# Altium project STM32H7-Board.PrjPCB
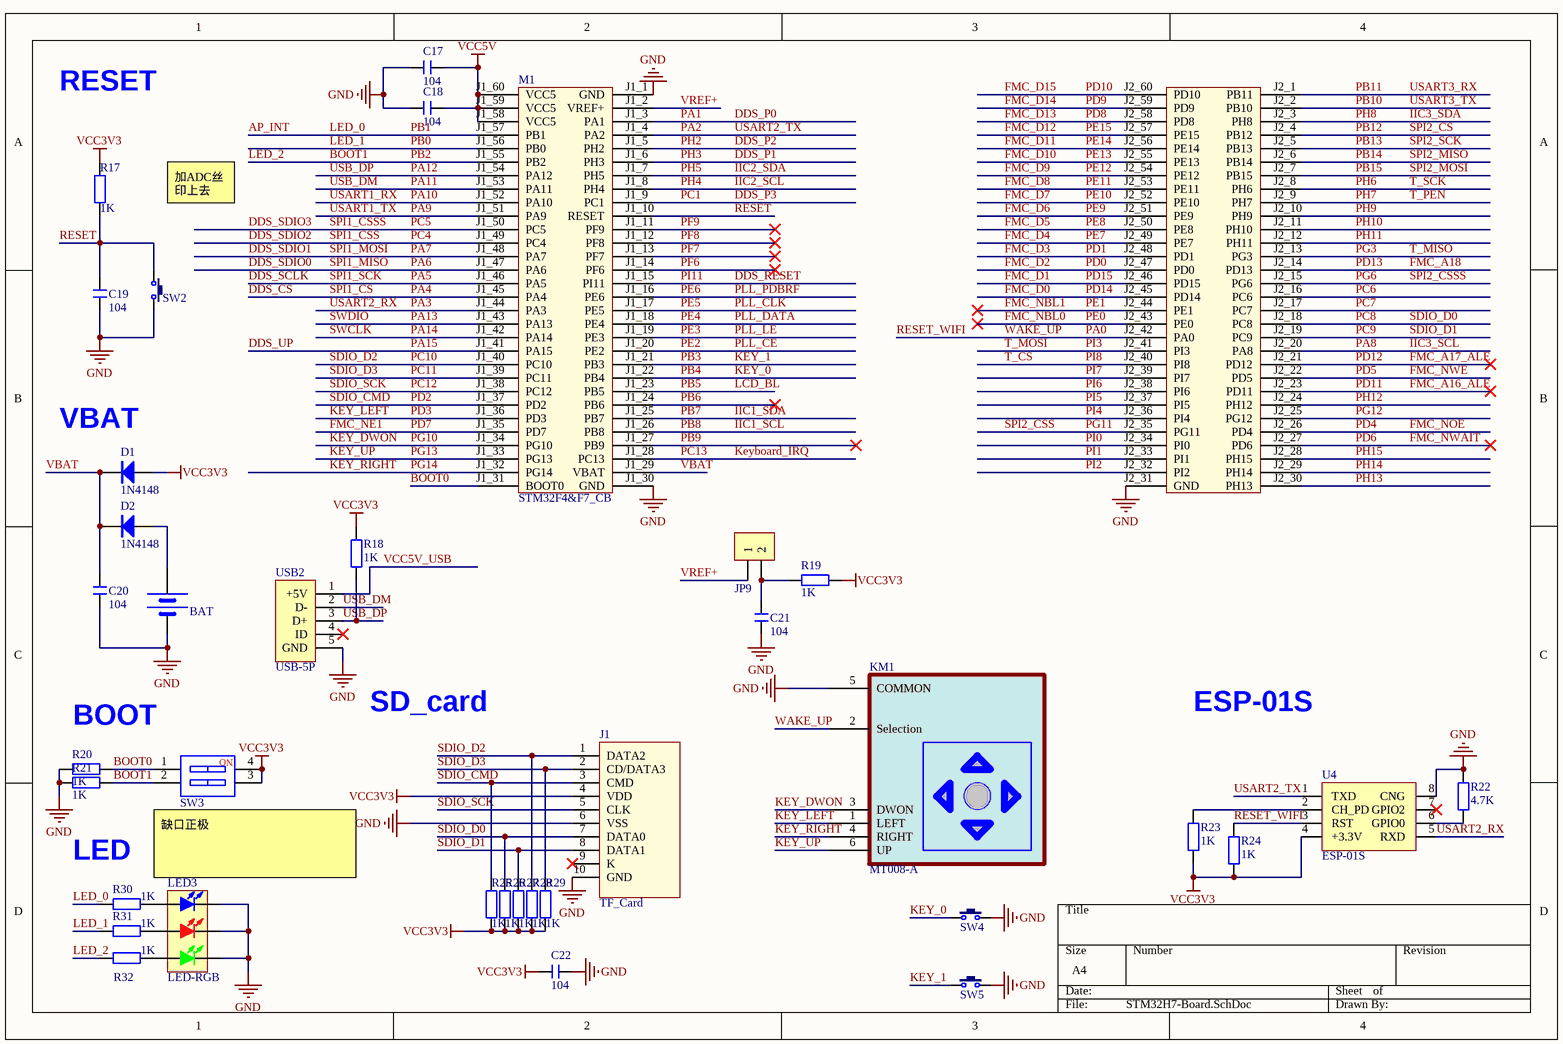
[diagram p0: STM32H7-Board.SchDoc]
5 sheets, 93 parts. Net scope: global (net labels, ports and power ports of the same name join across sheets).
Board file: STM32H7-Board.PcbDoc
Sheets:
  STM32H7-Board.SchDoc
  stlinkv2.1.SchDoc
  Power.SchDoc
  ports.SchDoc
  Sensors.SchDoc

## Sheet STM32H7-Board.SchDoc
size A4

### Parts
BAT  BATT  [BATM]  (value not drawn)
C17  104  [C 0603_L]
C18  104  [C 0603_L]
C19  104  [C 0603_L]
C20  104  [C 0603_L]
C21  104  [C 0603_L]
C22  104  [C 0603_L]
D1  1N4148  [SOD-323]
D2  1N4148  [MINI_MELF (LL34)]
J1  TF_Card  [Micro SD]
JP9  HDR-1X2  [HDR2.54-LI-2P]  (value not drawn)
KM1  MT008-A  [JOY_MT008-A]
LED3  LED-RGB  [LED 5050]
M1  STM32F4&F7_CB  [STM32F4&F7_CB]
R17  1K  [R 0603_L]
R18  1K  [R 0603_L]
R19  1K  [R 0603_L]
R20  1K  [R 0603_L]
R21  1K  [R 0603_L]
R22  4.7K  [R 0603_L]
R23  1K  [R 0603_L]
R24  1K  [R 0603_L]
R25  1K  [R 0603_L]
R26  1K  [R 0603_L]
R27  1K  [R 0603_L]
R28  1K  [R 0603_L]
R29  1K  [R 0603_L]
R30  1K  [R 0603_L]
R31  1K  [R 0603_L]
R32  1K  [R 0603_L]
SW2  3x6x5  [TSW SMD-3*6*2.5]  (value not drawn)
SW3  CSW-2P  [CSW1.27 SMD-2P]  (value not drawn)
SW4  3x6x5  [SODFL700X110-2N]  (value not drawn)
SW5  3x6x5  [SODFL700X110-2N]  (value not drawn)
U4  ESP-01S  [ESP-01S]
USB2  USB-5P  [USB-MICRO_B]

### Nets
GND: BAT.2(GND) C17.1 C18.1 C19.1 C20.1 C21.1 C22.2 J1.6(VSS) J1.10(GND) KM1.5(COMMON) LED3.2(BULE_K) LED3.4(RED_K) LED3.6(GREEN_K) M1.J1_1(GND) M1.J1_30(GND) M1.J2_31(GND) R20.1 R21.1 R22.2 SW2.2 SW4.2 SW5.2 U4.8(CNG) USB2.5(GND)
VCC3V3: C22.1 D1.1(A) J1.4(VDD) R17.2 R18.1 R19.2 R23.2 R24.2 R25.1 R26.1 R27.1 R28.1 R29.1 SW3.3 SW3.4 U4.4(+3.3V)
VCC5V: C17.2 C18.2 M1.J1_58(VCC5) M1.J1_59(VCC5) M1.J1_60(VCC5)
AP_INT: M1.J1_57(PB1) R30.2  [also labelled LED_0, PB1]
BOOT0: M1.J1_31(BOOT0) R20.2 SW3.1
BOOT1: M1.J1_55(PB2) R21.2 R32.2 SW3.2  [also labelled LED_2, PB2]
DDS_CS: M1.J1_45(PA4)  [also labelled PA4, SPI1_CS]
DDS_P0: M1.J1_3(PA1)  [also labelled PA1]
DDS_P1: M1.J1_6(PH3)  [also labelled PH3]
DDS_P2: M1.J1_5(PH2)  [also labelled PH2]
DDS_P3: M1.J1_9(PC1)  [also labelled PC1]
DDS_RESET: M1.J1_15(PI11)  [also labelled PI11]
DDS_SCLK: M1.J1_46(PA5)  [also labelled PA5, SPI1_SCK]
DDS_SDIO0: M1.J1_47(PA6)  [also labelled PA6, SPI1_MISO]
DDS_SDIO1: M1.J1_48(PA7)  [also labelled PA7, SPI1_MOSI]
DDS_SDIO2: M1.J1_49(PC4)  [also labelled PC4, SPI1_CSS]
DDS_SDIO3: M1.J1_50(PC5)  [also labelled PC5, SPI1_CSSS]
DDS_UP: M1.J1_41(PA15)  [also labelled PA15]
FMC_A16_ALE: M1.J2_23(PD11)  [also labelled PD11]
FMC_A17_ALE: M1.J2_21(PD12)  [also labelled PD12]
FMC_A18: M1.J2_14(PD13)  [also labelled PD13]
FMC_D0: M1.J2_45(PD14)  [also labelled PD14]
FMC_D1: M1.J2_46(PD15)  [also labelled PD15]
FMC_D2: M1.J2_47(PD0)  [also labelled PD0]
FMC_D3: M1.J2_48(PD1)  [also labelled PD1]
FMC_D4: M1.J2_49(PE7)  [also labelled PE7]
FMC_D5: M1.J2_50(PE8)  [also labelled PE8]
FMC_D6: M1.J2_51(PE9)  [also labelled PE9]
FMC_D7: M1.J2_52(PE10)  [also labelled PE10]
FMC_D8: M1.J2_53(PE11)  [also labelled PE11]
FMC_D9: M1.J2_54(PE12)  [also labelled PE12]
FMC_D10: M1.J2_55(PE13)  [also labelled PE13]
FMC_D11: M1.J2_56(PE14)  [also labelled PE14]
FMC_D12: M1.J2_57(PE15)  [also labelled PE15]
FMC_D13: M1.J2_58(PD8)  [also labelled PD8]
FMC_D14: M1.J2_59(PD9)  [also labelled PD9]
FMC_D15: M1.J2_60(PD10)  [also labelled PD10]
FMC_NBL0: M1.J2_43(PE0)  [also labelled PE0]
FMC_NBL1: M1.J2_44(PE1)  [also labelled PE1]
FMC_NE1: M1.J1_35(PD7)  [also labelled PD7]
FMC_NOE: M1.J2_26(PD4)  [also labelled PD4]
FMC_NWAIT: M1.J2_27(PD6)  [also labelled PD6]
FMC_NWE: M1.J2_22(PD5)  [also labelled PD5]
IIC1_SCL: M1.J1_26(PB8)  [also labelled PB8]
IIC1_SDA: M1.J1_25(PB7)  [also labelled PB7]
IIC2_SCL: M1.J1_8(PH4)  [also labelled PH4]
IIC2_SDA: M1.J1_7(PH5)  [also labelled PH5]
IIC3_SCL: M1.J2_20(PA8)  [also labelled PA8]
IIC3_SDA: M1.J2_3(PH8)  [also labelled PH8]
KEY_0: M1.J1_22(PB4) SW4.1  [also labelled PB4]
KEY_1: M1.J1_21(PB3) SW5.1  [also labelled PB3]
KEY_DWON: KM1.3(DWON) M1.J1_34(PG10)  [also labelled PG10]
KEY_LEFT: KM1.1(LEFT) M1.J1_36(PD3)  [also labelled PD3]
KEY_RIGHT: KM1.4(RIGHT) M1.J1_32(PG14)  [also labelled PG14]
KEY_UP: KM1.6(UP) M1.J1_33(PG13)  [also labelled PG13]
Keyboard_IRQ: M1.J1_28(PC13)  [also labelled PC13]
LCD_BL: M1.J1_23(PB5)  [also labelled PB5]
LED_1: M1.J1_56(PB0) R31.2  [also labelled PB0]
PA0: KM1.2(Selection) M1.J2_42(PA0) R24.1 U4.3(RST)  [also labelled RESET_WIFI, WAKE_UP]
PA2: M1.J1_4(PA2) U4.1(TXD)  [also labelled USART2_TX]
PA3: M1.J1_44(PA3) U4.5(RXD)  [also labelled USART2_RX]
PA9: M1.J1_51(PA9)  [also labelled USART1_TX]
PA10: M1.J1_52(PA10)  [also labelled USART1_RX]
PA11: M1.J1_53(PA11) USB2.2(D-)  [also labelled USB_DM]
PA12: M1.J1_54(PA12) R18.2 USB2.3(D+)  [also labelled USB_DP]
PA13: M1.J1_43(PA13)  [also labelled SWDIO]
PA14: M1.J1_42(PA14)  [also labelled SWCLK]
PB6: M1.J1_24(PB6)
PB9: M1.J1_27(PB9)
PB10: M1.J2_2(PB10)  [also labelled USART3_TX]
PB11: M1.J2_1(PB11)  [also labelled USART3_RX]
PB12: M1.J2_4(PB12)  [also labelled SPI2_CS]
PB13: M1.J2_5(PB13)  [also labelled SPI2_SCK]
PB14: M1.J2_6(PB14)  [also labelled SPI2_MISO]
PB15: M1.J2_7(PB15)  [also labelled SPI2_MOSI]
PC6: M1.J2_16(PC6)
PC7: M1.J2_17(PC7)
PC8: J1.7(DATA0) M1.J2_18(PC8) R26.2  [also labelled SDIO_D0]
PC9: J1.8(DATA1) M1.J2_19(PC9) R27.2  [also labelled SDIO_D1]
PC10: J1.1(DATA2) M1.J1_40(PC10) R28.2  [also labelled SDIO_D2]
PC11: J1.2(CD/DATA3) M1.J1_39(PC11) R29.2  [also labelled SDIO_D3]
PC12: J1.5(CLK) M1.J1_38(PC12)  [also labelled SDIO_SCK]
PD2: J1.3(CMD) M1.J1_37(PD2) R25.2  [also labelled SDIO_CMD]
PE2: M1.J1_20(PE2)  [also labelled PLL_CE]
PE3: M1.J1_19(PE3)  [also labelled PLL_LE]
PE4: M1.J1_18(PE4)  [also labelled PLL_DATA]
PE5: M1.J1_17(PE5)  [also labelled PLL_CLK]
PE6: M1.J1_16(PE6)  [also labelled PLL_PDBRF]
PF6: M1.J1_14(PF6)
PF7: M1.J1_13(PF7)
PF8: M1.J1_12(PF8)
PF9: M1.J1_11(PF9)
PG3: M1.J2_13(PG3)  [also labelled T_MISO]
PG6: M1.J2_15(PG6)  [also labelled SPI2_CSSS]
PG11: M1.J2_35(PG11)  [also labelled SPI2_CSS]
PG12: M1.J2_25(PG12)
PH6: M1.J2_8(PH6)  [also labelled T_SCK]
PH7: M1.J2_9(PH7)  [also labelled T_PEN]
PH9: M1.J2_10(PH9)
PH10: M1.J2_11(PH10)
PH11: M1.J2_12(PH11)
PH12: M1.J2_24(PH12)
PH13: M1.J2_30(PH13)
PH14: M1.J2_29(PH14)
PH15: M1.J2_28(PH15)
PI0: M1.J2_34(PI0)
PI1: M1.J2_33(PI1)
PI2: M1.J2_32(PI2)
PI3: M1.J2_41(PI3)  [also labelled T_MOSI]
PI4: M1.J2_36(PI4)
PI5: M1.J2_37(PI5)
PI6: M1.J2_38(PI6)
PI7: M1.J2_39(PI7)
PI8: M1.J2_40(PI8)  [also labelled T_CS]
RESET: C19.2 M1.J1_10(RESET) R17.1 SW2.1
VBAT: C20.2 D1.2(K) D2.2(K) M1.J1_29(VBAT)
VCC5V_USB: USB2.1(+5V)
VREF+: JP9.1 M1.J1_2(VREF+)
NetBAT_1: BAT.1(VCC) D2.1(A)
NetC21_2: C21.2 JP9.2 R19.1
NetLED3_1: LED3.1(BULE_A) R30.1
NetLED3_3: LED3.3(RED_A) R31.1
NetLED3_5: LED3.5(GREEN_A) R32.1
NetR22_1: R22.1 U4.6(GPIO0)
NetR23_1: R23.1 U4.2(CH_PD)

Not connected (* = marked no-connect by the designer): J1 9(K)*; U4 7(GPIO2)*; USB2 4(ID)*

### Notes on the sheet
- RESET
- 加ADC丝印上去
- (near D1) VBAT
- BOOT
- SD_card
- ESP-01S
- LED
- 缺口正极
- (in symbol CSW-2P) NO

### Library data of the parts
BAT = BAT
C17-C22 = C: 无极性贴片电容; 版权归属: 源创客; BOM名称: 无极性贴片电容; 学习资源: www.ooocke.com
D1 D2 = 1N4148: 高速开关二极管; 版权归属: 源创客; BOM名称: 高速开关二极管; 学习资源: www.ooocke.com
J1 = TF_Card: TF卡座; 版权归属: 源创客; BOM名称: TF卡座; 学习资源: www.ooocke.com
JP9 = Header 2: 2P接插件; 版权归属: 源创客; BOM名称: 2P接插件; 学习资源: www.ooocke.com
KM1 = MT-008A
LED3 = LED-RGB: 三基色LED; 版权归属: 源创客; BOM名称: 三基色LED; 学习资源: www.ooocke.com
M1 = STM32F4&F7_CB: F429/746 Core Board
R17-R32 = R: 贴片电阻; 版权归属: 源创客; BOM名称: 贴片电阻; 学习资源: www.ooocke.com
SW2 SW4 SW5 = TSW 3x6: 3x6轻触开关; 版权归属: 源创客; BOM名称: 3x6轻触开关; 学习资源: www.ooocke.com
SW3 = CSW-2P: 2路编码开关; 版权归属: 源创客; BOM名称: 2路编码开关; 学习资源: www.ooocke.com
USB2 = USB-5P: 微型USB母座; 版权归属: 源创客; BOM名称: 微型USB母座; 学习资源: www.ooocke.com

## Sheet stlinkv2.1.SchDoc
size A4
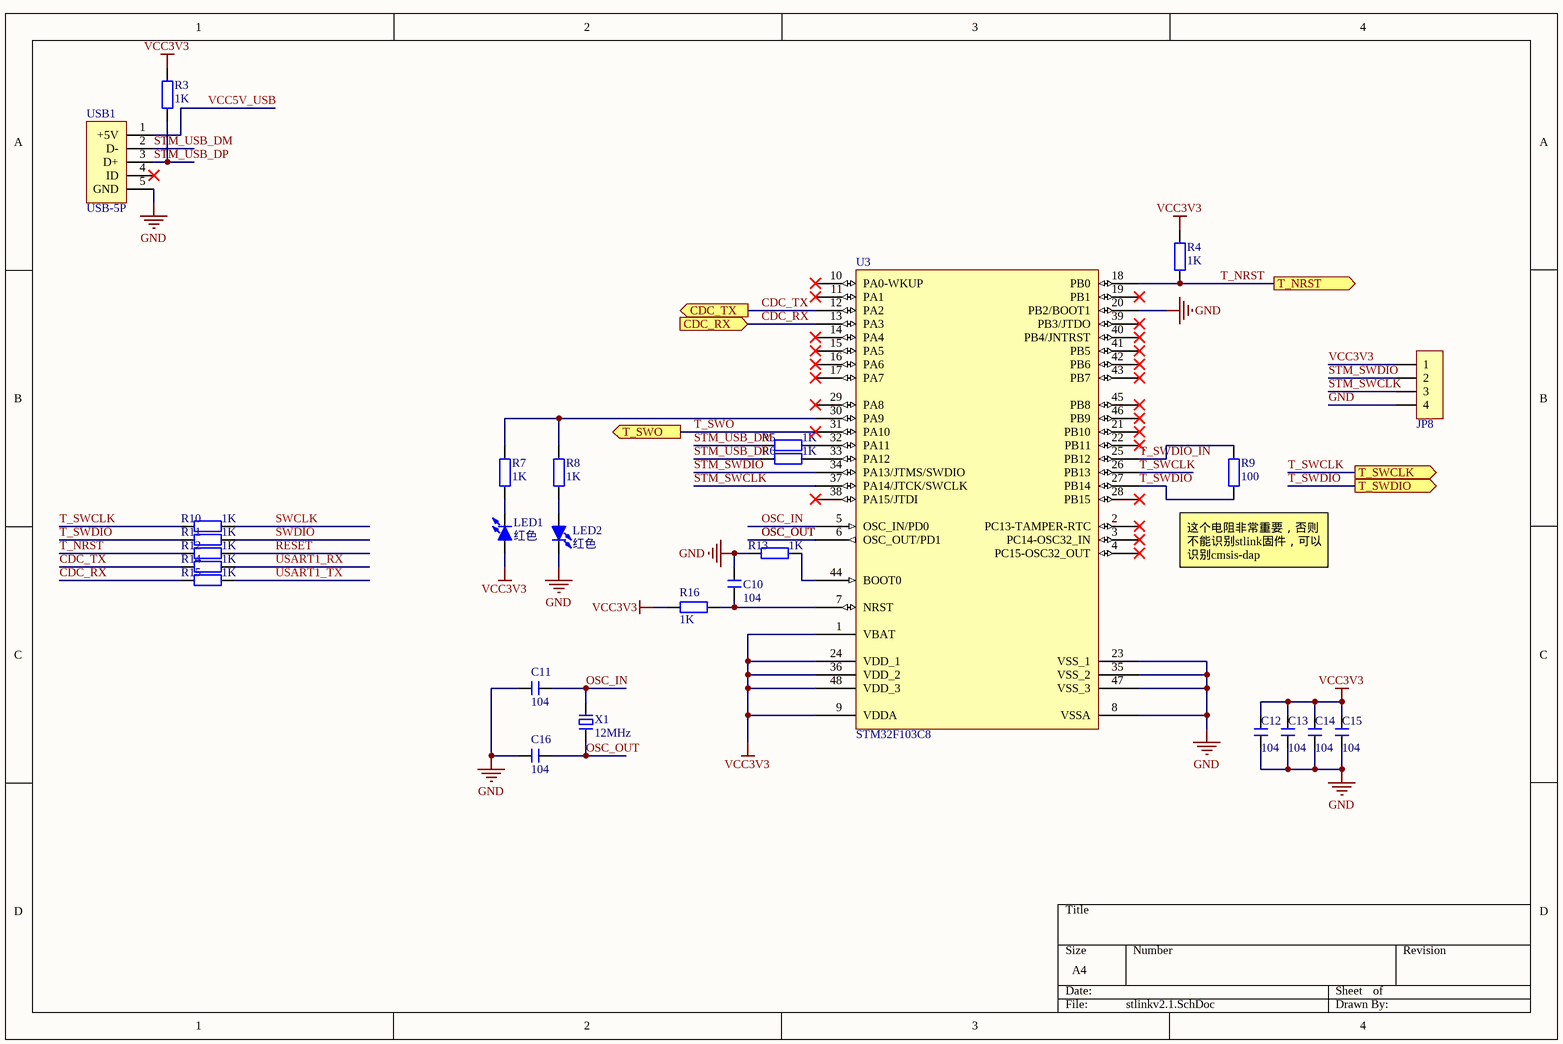
[diagram p1: stlinkv2.1.SchDoc]

### Parts
C10  104  [C 0603_L]
C11  104  [C 0603_L]
C12  104  [C 0603_L]
C13  104  [C 0603_L]
C14  104  [C 0603_L]
C15  104  [C 0603_L]
C16  104  [C 0603_L]
JP8  HDR-1X4  [HDR2.54-LI-4P]  (value not drawn)
LED1  红色  [LED 0603B]
LED2  红色  [LED 0603B]
R3  1K  [R 0603_L]
R4  1K  [R 0603_L]
R5  1K  [R 0603_L]
R6  1K  [R 0603_L]
R7  1K  [R 0603_L]
R8  1K  [R 0603_L]
R9  100  [R 0603_L]
R10  1K  [R 0603_L]
R11  1K  [R 0603_L]
R12  1K  [R 0603_L]
R13  1K  [R 0603_L]
R14  1K  [R 0603_L]
R15  1K  [R 0603_L]
R16  1K  [R 0603_L]
U3  STM32F103C8  [LQFP48 7X7_M]
USB1  USB-5P  [USB-MICRO_B]
X1  12MHz  [OSC 5032-2P]

### Ports
CDC_RX (in), CDC_TX (out), T_NRST (out), T_SWCLK (out), T_SWDIO (out), T_SWO (out)

### Nets
GND: C10.1 C11.1 C12.2 C13.2 C14.2 C15.2 C16.1 JP8.4 LED2.2(K) R13.2 U3.8(VSSA) U3.20(PB2/BOOT1) U3.23(VSS_1) U3.35(VSS_2) U3.47(VSS_3) USB1.5(GND)
VCC3V3: C12.1 C13.1 C14.1 C15.1 JP8.1 LED1.1(A) R3.1 R4.2 R16.2 U3.1(VBAT) U3.9(VDDA) U3.24(VDD_1) U3.36(VDD_2) U3.48(VDD_3)
CDC_RX: R15.2 U3.13(PA3) ; port CDC_RX
CDC_TX: R14.2 U3.12(PA2) ; port CDC_TX
OSC_IN: C11.2 U3.5(OSC_IN/PD0) X1.2
OSC_OUT: C16.2 U3.6(OSC_OUT/PD1) X1.1
RESET: R12.1
STM_SWCLK: JP8.3 U3.37(PA14/JTCK/SWCLK)
STM_SWDIO: JP8.2 U3.34(PA13/JTMS/SWDIO)
STM_USB_DM: R5.2 USB1.2(D-)
STM_USB_DP: R3.2 R6.2 USB1.3(D+)
SWCLK: R10.1  [project net PA14]
SWDIO: R11.1  [project net PA13]
T_NRST: R4.1 R12.2 U3.18(PB0) ; port T_NRST
T_SWCLK: R10.2 U3.26(PB13) ; port T_SWCLK
T_SWDIO: R9.1 R11.2 U3.27(PB14) ; port T_SWDIO
T_SWDIO_IN: R9.2 U3.25(PB12)
T_SWO: U3.31(PA10) ; port T_SWO
USART1_RX: R14.1  [project net PA10]
USART1_TX: R15.1  [project net PA9]
VCC5V_USB: USB1.1(+5V)
NetC10_2: C10.2 R16.1 U3.7(NRST)
NetLED1_2: LED1.2(K) R7.1
NetLED2_1: LED2.1(A) R8.1
NetR5_1: R5.1 U3.32(PA11)
NetR6_1: R6.1 U3.33(PA12)
NetR7_2: R7.2 R8.2 U3.30(PA9)
NetR13_1: R13.1 U3.44(BOOT0)

Not connected (* = marked no-connect by the designer): U3 2(PC13-TAMPER-RTC)* 3(PC14-OSC32_IN)* 4(PC15-OSC32_OUT)* 10(PA0-WKUP)* 11(PA1)* 14(PA4)* 15(PA5)* 16(PA6)* 17(PA7)* 19(PB1)* 21(PB10)* 22(PB11)* 28(PB15)* 29(PA8)* 38(PA15/JTDI)* 39(PB3/JTDO)* 40(PB4/JNTRST)* 41(PB5)* 42(PB6)* 43(PB7)* 45(PB8)* 46(PB9)*; USB1 4(ID)*

### Notes on the sheet
- (near R9) 这个电阻非常重要，否则不能识别stlink固件，可以识别cmsis-dap

### Library data of the parts
C10-C16 = C: 无极性贴片电容; 版权归属: 源创客; BOM名称: 无极性贴片电容; 学习资源: www.ooocke.com
JP8 = Header 4: 4P接插件; 版权归属: 源创客; BOM名称: 4P接插件; 学习资源: www.ooocke.com
LED1 LED2 = LED-SMD: 贴片LED; 版权归属: 源创客; BOM名称: 贴片LED; 学习资源: www.ooocke.com
R3-R16 = R: 贴片电阻; 版权归属: 源创客; BOM名称: 贴片电阻; 学习资源: www.ooocke.com
U3 = STM32F103C8: Flaah:64/RAM:20/IO:36; BOM名称: 32位STM单片机; 版权归属: 源创客; 学习资源: www.ooocke.com
USB1 = USB-5P: 微型USB母座; 版权归属: 源创客; BOM名称: 微型USB母座; 学习资源: www.ooocke.com
X1 = XTAL-2P: 2脚无源脚晶振; 版权归属: 源创客; BOM名称: 2脚无源脚晶振; 学习资源: www.ooocke.com

## Sheet Power.SchDoc
size A4
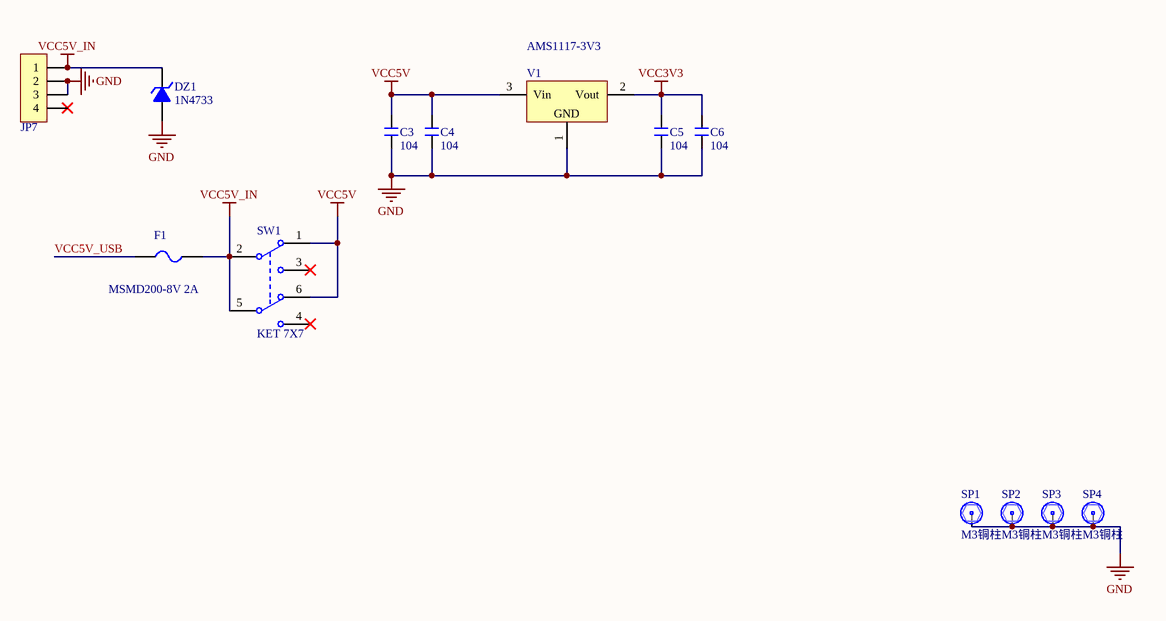
[diagram p2: Power.SchDoc]

### Parts
C3  104  [C 1812_L]
C4  104  [C 1812_L]
C5  104  [C 1206_M]
C6  104  [C 1206_M]
DZ1  1N4733  [SMA]
F1  MSMD200-8V 2A  [FU 1210]
JP7  HDR-1X4  [VH3.96-LI-4P]  (value not drawn)
SP1  M3铜柱  [M3x4_L]
SP2  M3铜柱  [M3x4_L]
SP3  M3铜柱  [M3x4_L]
SP4  M3铜柱  [M3x4_L]
SW1  KET 7X7  [KFT DIP-7X7]
V1  AMS1117-3V3  [SOT223_L]

### Nets
GND: C3.1 C4.1 C5.1 C6.1 DZ1.1(A) JP7.2 JP7.3 SP1.1 SP2.1 SP3.1 SP4.1 V1.1(GND)
VCC3V3: C5.2 C6.2 V1.2(Vout)
VCC5V: C3.2 C4.2 SW1.1(NC1) SW1.6(NC2) V1.3(Vin)
VCC5V_IN: DZ1.2(K) F1.2 JP7.1 SW1.2(COM2) SW1.5(COM2)
VCC5V_USB: F1.1

Not connected (* = marked no-connect by the designer): JP7 4*; SW1 3(NO1)* 4(NO2)*

### Library data of the parts
C3-C6 = C: 无极性贴片电容; 版权归属: 源创客; BOM名称: 无极性贴片电容; 学习资源: www.ooocke.com
DZ1 = 1N4733: 5.1V/1W稳压管; 版权归属: 源创客; BOM名称: 5.1V/1W稳压管; 学习资源: www.ooocke.com
F1 = FU: 贴片保险丝; 版权归属: 源创客; BOM名称: 贴片保险丝; 学习资源: www.ooocke.com
JP7 = Header 4: 4P接插件; 版权归属: 源创客; BOM名称: 4P接插件; 学习资源: www.ooocke.com
SP1-SP4 = 铜柱小焊盘: 铜柱; 版权归属: 源创客; BOM名称: 铜柱; 学习资源: www.ooocke.com
SW1 = KET 7X7: 7*7自锁开关; 版权归属: 源创客; BOM名称: 7*7自锁开关; 学习资源: www.ooocke.com
V1 = AMS1117: 三端稳压芯片; BOM名称: 稳压芯片; 版权归属: 源创客; 学习资源: www.ooocke.com

## Sheet ports.SchDoc
size A4
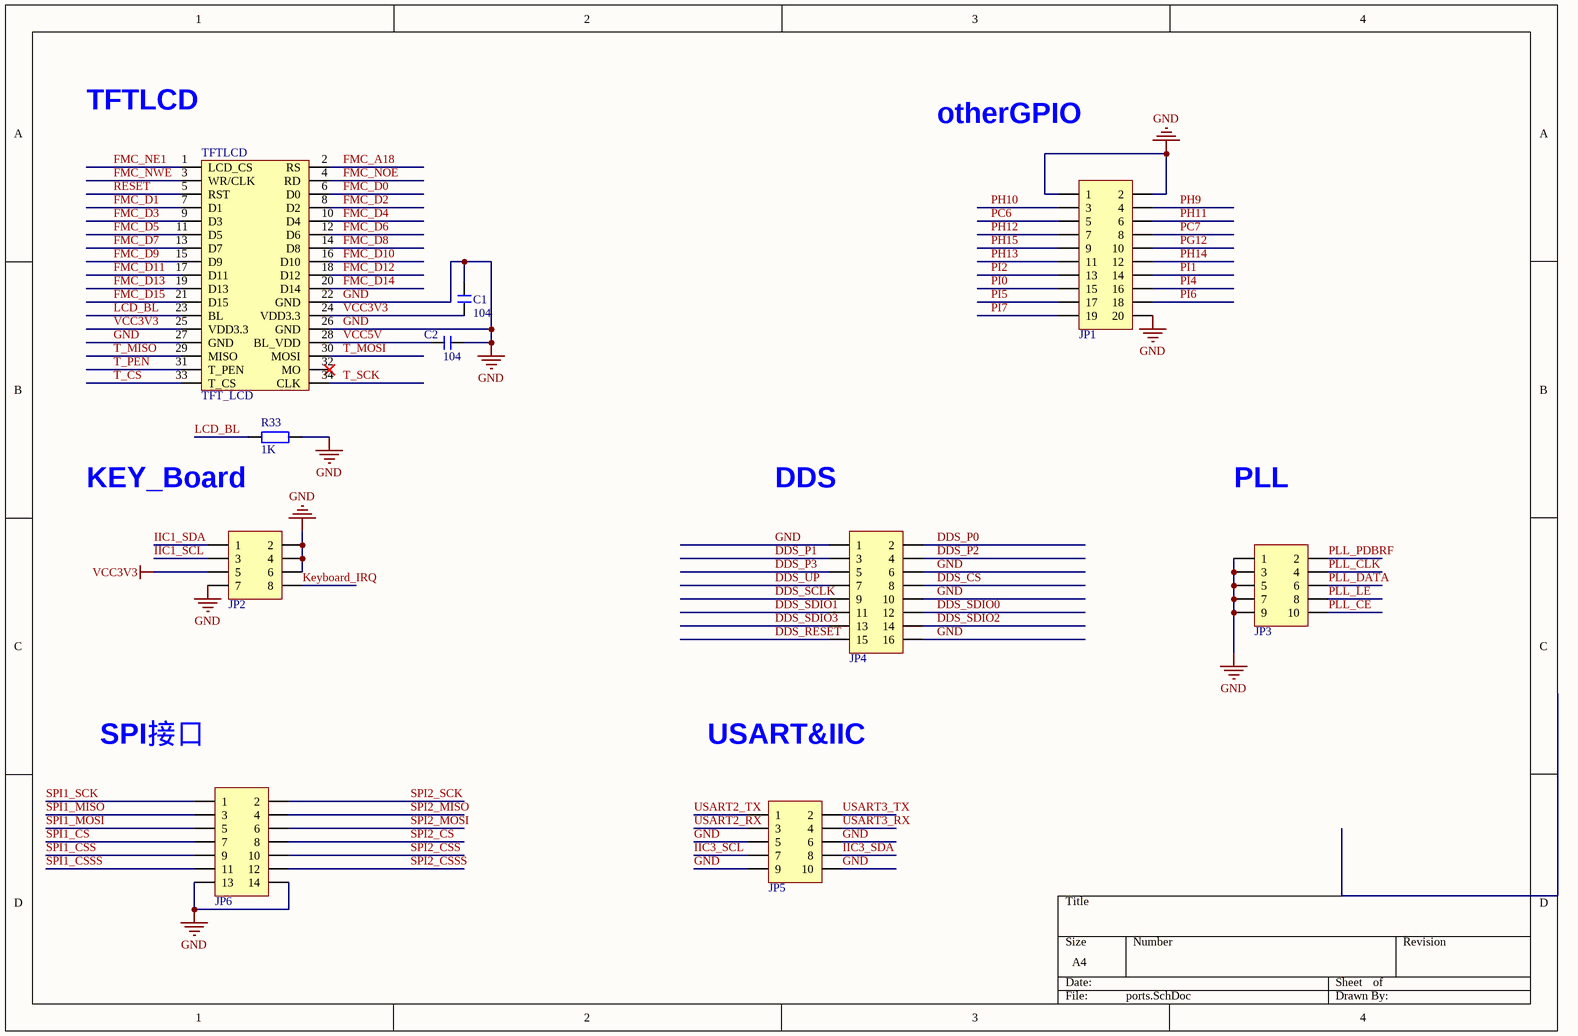
[diagram p3: ports.SchDoc]

### Parts
C1  104  [C 0603_L]
C2  104  [C 0603_L]
JP1  Header 2X10  [IDC2.54-LI-2x10P]  (value not drawn)
JP2  Header 4X2  [IDC2.54-LI-2x4P]  (value not drawn)
JP3  Header 5X2  [IDC2.54-LI-2x5P]  (value not drawn)
JP4  Header 8X2  [IDC2.54-LI-2x8P]  (value not drawn)
JP5  Header 5X2  [IDC2.54-LI-2x5P]  (value not drawn)
JP6  Header 2X7  [IDC2.54-LI-2x7P]  (value not drawn)
R33  1K  [R 0603_L]
TFTLCD  TFT_LCD  [db2*17-4.3]

### Nets
GND: C1.2 C2.1 JP1.1 JP1.2 JP1.20 JP2.2 JP2.4 JP2.6 JP2.7 JP3.1 JP3.3 JP3.5 JP3.7 JP3.9 JP4.1 JP4.6 JP4.10 JP4.16 JP5.5 JP5.6 JP5.9 JP5.10 JP6.13 JP6.14 R33.2 TFTLCD.22(GND) TFTLCD.26(GND) TFTLCD.27(GND)
VCC3V3: C1.1 JP2.5 TFTLCD.24(VDD3.3) TFTLCD.25(VDD3.3)
VCC5V: C2.2 TFTLCD.28(BL_VDD)
DDS_CS: JP4.8 JP6.7  [also labelled SPI1_CS]
DDS_P0: JP4.2
DDS_P1: JP4.3
DDS_P2: JP4.4
DDS_P3: JP4.5
DDS_RESET: JP4.15
DDS_SCLK: JP4.9 JP6.1  [also labelled SPI1_SCK]
DDS_SDIO0: JP4.12 JP6.3  [also labelled SPI1_MISO]
DDS_SDIO1: JP4.11 JP6.5  [also labelled SPI1_MOSI]
DDS_SDIO2: JP4.14 JP6.9  [also labelled SPI1_CSS]
DDS_SDIO3: JP4.13 JP6.11  [also labelled SPI1_CSSS]
DDS_UP: JP4.7
FMC_A18: TFTLCD.2(RS)
FMC_D0: TFTLCD.6(D0)
FMC_D1: TFTLCD.7(D1)
FMC_D2: TFTLCD.8(D2)
FMC_D3: TFTLCD.9(D3)
FMC_D4: TFTLCD.10(D4)
FMC_D5: TFTLCD.11(D5)
FMC_D6: TFTLCD.12(D6)
FMC_D7: TFTLCD.13(D7)
FMC_D8: TFTLCD.14(D8)
FMC_D9: TFTLCD.15(D9)
FMC_D10: TFTLCD.16(D10)
FMC_D11: TFTLCD.17(D11)
FMC_D12: TFTLCD.18(D12)
FMC_D13: TFTLCD.19(D13)
FMC_D14: TFTLCD.20(D14)
FMC_D15: TFTLCD.21(D15)
FMC_NE1: TFTLCD.1(LCD_CS)
FMC_NOE: TFTLCD.4(RD)
FMC_NWE: TFTLCD.3(WR/CLK)
IIC1_SCL: JP2.3
IIC1_SDA: JP2.1
IIC3_SCL: JP5.7
IIC3_SDA: JP5.8
Keyboard_IRQ: JP2.8
LCD_BL: R33.1 TFTLCD.23(BL)
PC6: JP1.5
PC7: JP1.8
PG12: JP1.10
PH9: JP1.4
PH10: JP1.3
PH11: JP1.6
PH12: JP1.7
PH13: JP1.11
PH14: JP1.12
PH15: JP1.9
PI0: JP1.15
PI1: JP1.14
PI2: JP1.13
PI4: JP1.16
PI5: JP1.17
PI6: JP1.18
PI7: JP1.19
PLL_CE: JP3.10  [project net PE2]
PLL_CLK: JP3.4  [project net PE5]
PLL_DATA: JP3.6  [project net PE4]
PLL_LE: JP3.8  [project net PE3]
PLL_PDBRF: JP3.2  [project net PE6]
RESET: TFTLCD.5(RST)
SPI2_CS: JP6.8  [project net PB12]
SPI2_CSS: JP6.10  [project net PG11]
SPI2_CSSS: JP6.12  [project net PG6]
SPI2_MISO: JP6.4  [project net PB14]
SPI2_MOSI: JP6.6  [project net PB15]
SPI2_SCK: JP6.2  [project net PB13]
T_CS: TFTLCD.33(T_CS)  [project net PI8]
T_MISO: TFTLCD.29(MISO)  [project net PG3]
T_MOSI: TFTLCD.30(MOSI)  [project net PI3]
T_PEN: TFTLCD.31(T_PEN)  [project net PH7]
T_SCK: TFTLCD.34(CLK)  [project net PH6]
USART2_RX: JP5.3  [project net PA3]
USART2_TX: JP5.1  [project net PA2]
USART3_RX: JP5.4  [project net PB11]
USART3_TX: JP5.2  [project net PB10]

Not connected (* = marked no-connect by the designer): TFTLCD 32(MO)*

### Notes on the sheet
- TFTLCD
- otherGPIO
- KEY_Board
- DDS
- PLL
- SPI接口
- USART&IIC

### Library data of the parts
C1 C2 = C: 无极性贴片电容; 版权归属: 源创客; BOM名称: 无极性贴片电容; 学习资源: www.ooocke.com
JP1 = Header 10X2: 10*2P接插件; 版权归属: 源创客; BOM名称: 10*2P接插件; 学习资源: www.ooocke.com
JP2 = Header 4X2: 4*2P接插件; 版权归属: 源创客; BOM名称: 4*2P接插件; 学习资源: www.ooocke.com
JP3 JP5 = Header 5X2: 5*2P接插件; 版权归属: 源创客; BOM名称: 5*2P接插件; 学习资源: www.ooocke.com
JP4 = Header 8X2: 8*2P接插件; 版权归属: 源创客; BOM名称: 8*2P接插件; 学习资源: www.ooocke.com
JP6 = Header 7X2: 7*2P接插件; 版权归属: 源创客; BOM名称: 7*2P接插件; 学习资源: www.ooocke.com
R33 = R: 贴片电阻; 版权归属: 源创客; BOM名称: 贴片电阻; 学习资源: www.ooocke.com

## Sheet Sensors.SchDoc
size A4
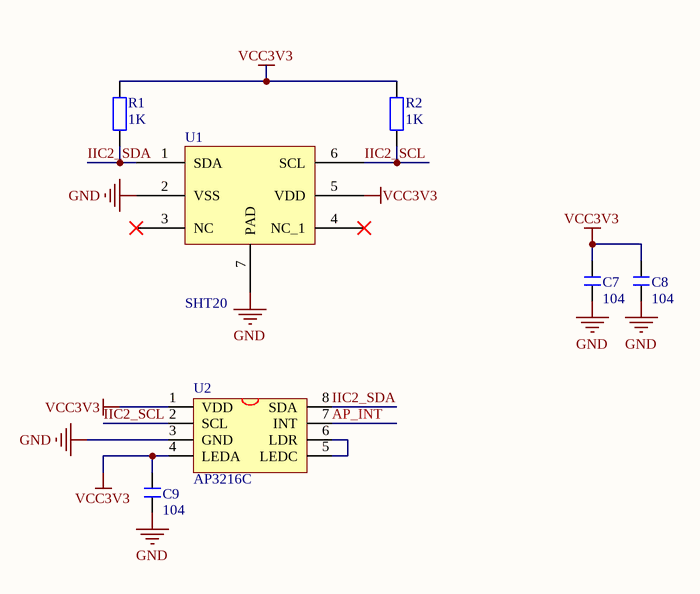
[diagram p4: Sensors.SchDoc]

### Parts
C7  104  [C 0603_L]
C8  104  [C 0603_L]
C9  104  [C 0603_L]
R1  1K  [R 0603_L]
R2  1K  [R 0603_L]
U1  SHT20  [sht20]
U2  AP3216C  [DFN8]

### Nets
GND: C7.2 C8.2 C9.2 U1.2(VSS) U1.7(PAD) U2.3(GND)
VCC3V3: C7.1 C8.1 C9.1 R1.1 R2.1 U1.5(VDD) U2.1(VDD) U2.4(LEDA)
AP_INT: U2.7(INT)
IIC2_SCL: R2.2 U1.6(SCL) U2.2(SCL)
IIC2_SDA: R1.2 U1.1(SDA) U2.8(SDA)
NetU2_5: U2.5(LEDC) U2.6(LDR)

Not connected (* = marked no-connect by the designer): U1 3(NC)* 4(NC_1)*

### Library data of the parts
C7-C9 = C: 无极性贴片电容; 版权归属: 源创客; BOM名称: 无极性贴片电容; 学习资源: www.ooocke.com
R1 R2 = R: 贴片电阻; 版权归属: 源创客; BOM名称: 贴片电阻; 学习资源: www.ooocke.com
U2 = AP3216C: ALS+PS Sensor

## Nets that join several sheets
GND: STM32H7-Board (24 pins), stlinkv2.1 (16 pins), Power (12 pins), ports (28 pins), Sensors (6 pins)
VCC3V3: STM32H7-Board (16 pins), stlinkv2.1 (14 pins), Power (C5.2 C6.2 V1.2), ports (C1.1 JP2.5 TFTLCD.24 TFTLCD.25), Sensors (8 pins)
VCC5V: STM32H7-Board (5 pins), Power (5 pins), ports (C2.2 TFTLCD.28)
AP_INT: STM32H7-Board (M1.J1_57 R30.2), Sensors (U2.7)
DDS_CS: STM32H7-Board (M1.J1_45), ports (JP4.8 JP6.7)
DDS_P0: STM32H7-Board (M1.J1_3), ports (JP4.2)
DDS_P1: STM32H7-Board (M1.J1_6), ports (JP4.3)
DDS_P2: STM32H7-Board (M1.J1_5), ports (JP4.4)
DDS_P3: STM32H7-Board (M1.J1_9), ports (JP4.5)
DDS_RESET: STM32H7-Board (M1.J1_15), ports (JP4.15)
DDS_SCLK: STM32H7-Board (M1.J1_46), ports (JP4.9 JP6.1)
DDS_SDIO0: STM32H7-Board (M1.J1_47), ports (JP4.12 JP6.3)
DDS_SDIO1: STM32H7-Board (M1.J1_48), ports (JP4.11 JP6.5)
DDS_SDIO2: STM32H7-Board (M1.J1_49), ports (JP4.14 JP6.9)
DDS_SDIO3: STM32H7-Board (M1.J1_50), ports (JP4.13 JP6.11)
DDS_UP: STM32H7-Board (M1.J1_41), ports (JP4.7)
FMC_A18: STM32H7-Board (M1.J2_14), ports (TFTLCD.2)
FMC_D0: STM32H7-Board (M1.J2_45), ports (TFTLCD.6)
FMC_D1: STM32H7-Board (M1.J2_46), ports (TFTLCD.7)
FMC_D2: STM32H7-Board (M1.J2_47), ports (TFTLCD.8)
FMC_D3: STM32H7-Board (M1.J2_48), ports (TFTLCD.9)
FMC_D4: STM32H7-Board (M1.J2_49), ports (TFTLCD.10)
FMC_D5: STM32H7-Board (M1.J2_50), ports (TFTLCD.11)
FMC_D6: STM32H7-Board (M1.J2_51), ports (TFTLCD.12)
FMC_D7: STM32H7-Board (M1.J2_52), ports (TFTLCD.13)
FMC_D8: STM32H7-Board (M1.J2_53), ports (TFTLCD.14)
FMC_D9: STM32H7-Board (M1.J2_54), ports (TFTLCD.15)
FMC_D10: STM32H7-Board (M1.J2_55), ports (TFTLCD.16)
FMC_D11: STM32H7-Board (M1.J2_56), ports (TFTLCD.17)
FMC_D12: STM32H7-Board (M1.J2_57), ports (TFTLCD.18)
FMC_D13: STM32H7-Board (M1.J2_58), ports (TFTLCD.19)
FMC_D14: STM32H7-Board (M1.J2_59), ports (TFTLCD.20)
FMC_D15: STM32H7-Board (M1.J2_60), ports (TFTLCD.21)
FMC_NE1: STM32H7-Board (M1.J1_35), ports (TFTLCD.1)
FMC_NOE: STM32H7-Board (M1.J2_26), ports (TFTLCD.4)
FMC_NWE: STM32H7-Board (M1.J2_22), ports (TFTLCD.3)
IIC1_SCL: STM32H7-Board (M1.J1_26), ports (JP2.3)
IIC1_SDA: STM32H7-Board (M1.J1_25), ports (JP2.1)
IIC2_SCL: STM32H7-Board (M1.J1_8), Sensors (R2.2 U1.6 U2.2)
IIC2_SDA: STM32H7-Board (M1.J1_7), Sensors (R1.2 U1.1 U2.8)
IIC3_SCL: STM32H7-Board (M1.J2_20), ports (JP5.7)
IIC3_SDA: STM32H7-Board (M1.J2_3), ports (JP5.8)
Keyboard_IRQ: STM32H7-Board (M1.J1_28), ports (JP2.8)
LCD_BL: STM32H7-Board (M1.J1_23), ports (R33.1 TFTLCD.23)
PA2: STM32H7-Board (M1.J1_4 U4.1), ports (JP5.1)
PA3: STM32H7-Board (M1.J1_44 U4.5), ports (JP5.3)
PA9: STM32H7-Board (M1.J1_51), stlinkv2.1 (R15.1)
PA10: STM32H7-Board (M1.J1_52), stlinkv2.1 (R14.1)
PA13: STM32H7-Board (M1.J1_43), stlinkv2.1 (R11.1)
PA14: STM32H7-Board (M1.J1_42), stlinkv2.1 (R10.1)
PB10: STM32H7-Board (M1.J2_2), ports (JP5.2)
PB11: STM32H7-Board (M1.J2_1), ports (JP5.4)
PB12: STM32H7-Board (M1.J2_4), ports (JP6.8)
PB13: STM32H7-Board (M1.J2_5), ports (JP6.2)
PB14: STM32H7-Board (M1.J2_6), ports (JP6.4)
PB15: STM32H7-Board (M1.J2_7), ports (JP6.6)
PC6: STM32H7-Board (M1.J2_16), ports (JP1.5)
PC7: STM32H7-Board (M1.J2_17), ports (JP1.8)
PE2: STM32H7-Board (M1.J1_20), ports (JP3.10)
PE3: STM32H7-Board (M1.J1_19), ports (JP3.8)
PE4: STM32H7-Board (M1.J1_18), ports (JP3.6)
PE5: STM32H7-Board (M1.J1_17), ports (JP3.4)
PE6: STM32H7-Board (M1.J1_16), ports (JP3.2)
PG3: STM32H7-Board (M1.J2_13), ports (TFTLCD.29)
PG6: STM32H7-Board (M1.J2_15), ports (JP6.12)
PG11: STM32H7-Board (M1.J2_35), ports (JP6.10)
PG12: STM32H7-Board (M1.J2_25), ports (JP1.10)
PH6: STM32H7-Board (M1.J2_8), ports (TFTLCD.34)
PH7: STM32H7-Board (M1.J2_9), ports (TFTLCD.31)
PH9: STM32H7-Board (M1.J2_10), ports (JP1.4)
PH10: STM32H7-Board (M1.J2_11), ports (JP1.3)
PH11: STM32H7-Board (M1.J2_12), ports (JP1.6)
PH12: STM32H7-Board (M1.J2_24), ports (JP1.7)
PH13: STM32H7-Board (M1.J2_30), ports (JP1.11)
PH14: STM32H7-Board (M1.J2_29), ports (JP1.12)
PH15: STM32H7-Board (M1.J2_28), ports (JP1.9)
PI0: STM32H7-Board (M1.J2_34), ports (JP1.15)
PI1: STM32H7-Board (M1.J2_33), ports (JP1.14)
PI2: STM32H7-Board (M1.J2_32), ports (JP1.13)
PI3: STM32H7-Board (M1.J2_41), ports (TFTLCD.30)
PI4: STM32H7-Board (M1.J2_36), ports (JP1.16)
PI5: STM32H7-Board (M1.J2_37), ports (JP1.17)
PI6: STM32H7-Board (M1.J2_38), ports (JP1.18)
PI7: STM32H7-Board (M1.J2_39), ports (JP1.19)
PI8: STM32H7-Board (M1.J2_40), ports (TFTLCD.33)
RESET: STM32H7-Board (C19.2 M1.J1_10 R17.1 SW2.1), stlinkv2.1 (R12.1), ports (TFTLCD.5)
VCC5V_USB: STM32H7-Board (USB2.1), stlinkv2.1 (USB1.1), Power (F1.1)